# Altium schematic sheet STM32.SchDoc
size A4
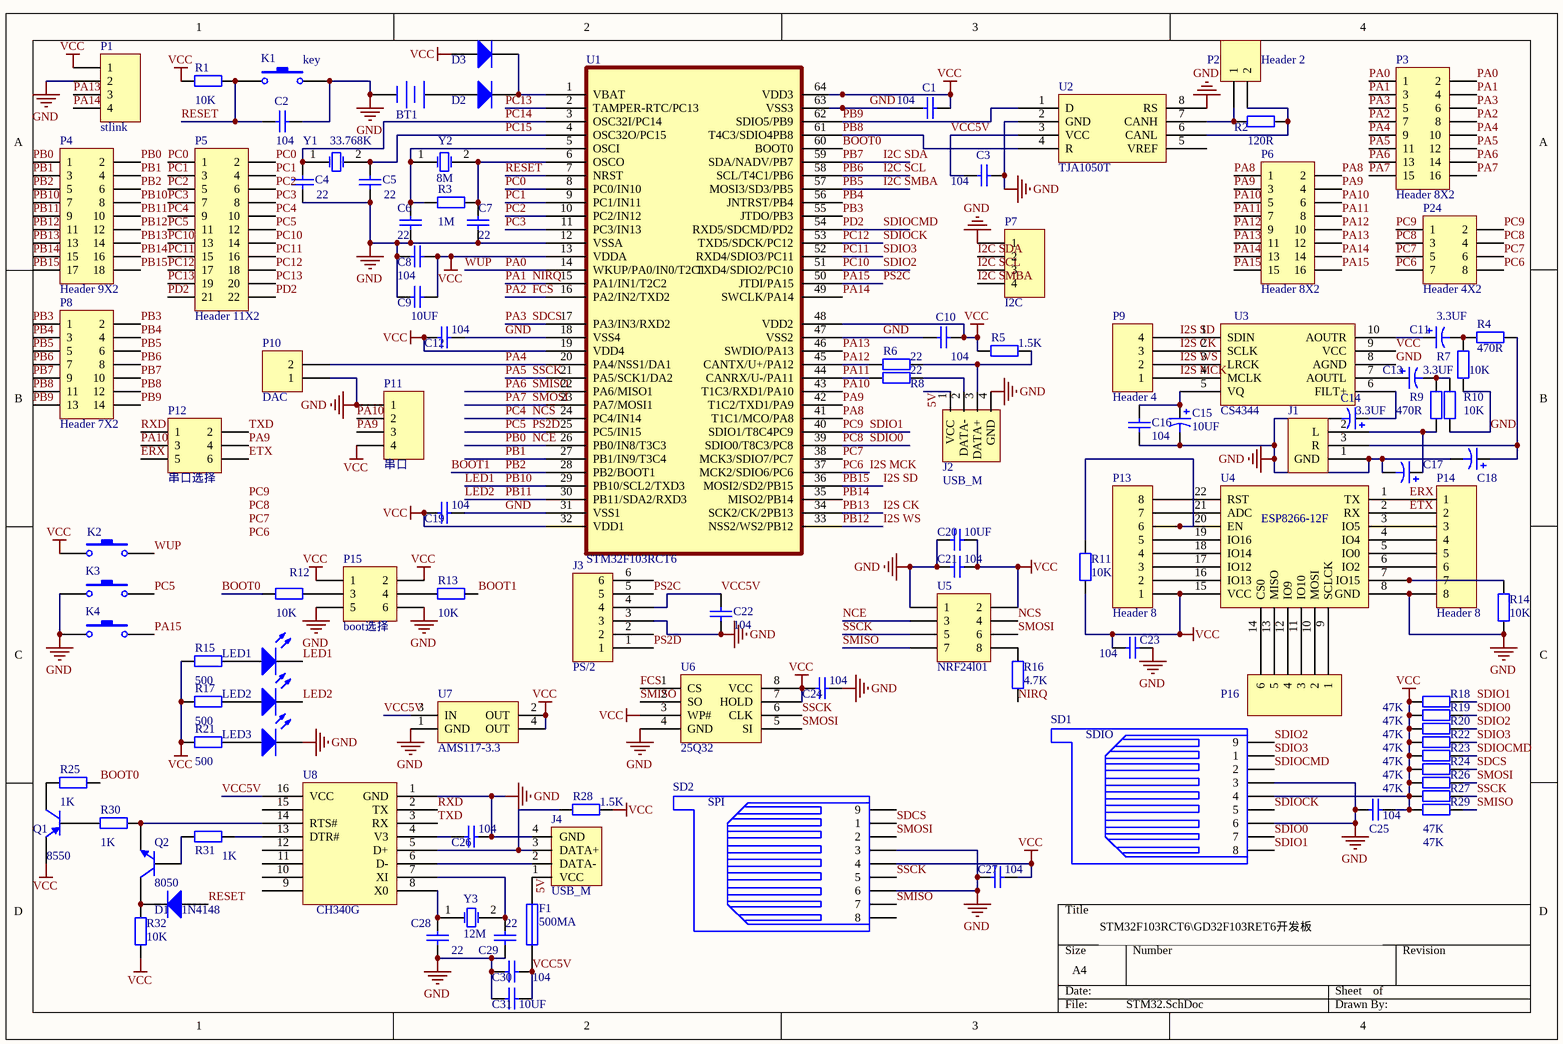
[diagram p0: STM32.SchDoc]

## Parts
BT1  电池  [电池座]  (value not drawn)
C1  value 104  [6-0805_N]  (hidden comment: Cap)
C2  value 104  [6-0805_N]  (hidden comment: Cap)
C3  value 104  [6-0805_N]  (hidden comment: Cap)
C4  value 22  [6-0805_N]  (hidden comment: Cap)
C5  value 22  [6-0805_N]  (hidden comment: Cap)
C6  value 22  [6-0805_N]  (hidden comment: Cap)
C7  value 22  [6-0805_N]  (hidden comment: Cap)
C8  value 104  [6-0805_N]  (hidden comment: Cap)
C9  value 10UF  [6-0805_N]  (hidden comment: Cap)
C10  value 104  [6-0805_N]  (hidden comment: Cap)
C11  value 3.3UF  [极性电容]  (hidden comment: Cap Pol3)
C12  value 104  [6-0805_N]  (hidden comment: Cap)
C13  value 3.3UF  [极性电容]  (hidden comment: Cap Pol3)
C14  value 3.3UF  [极性电容]  (hidden comment: Cap Pol3)
C15  value 10UF  [极性电容]  (hidden comment: Cap Pol3)
C16  value 104  [6-0805_N]  (hidden comment: Cap)
C17  Cap Pol3  [极性电容]  (value not drawn)
C18  Cap Pol3  [极性电容]  (value not drawn)
C19  value 104  [6-0805_N]  (hidden comment: Cap)
C20  value 10UF  [6-0805_N]  (hidden comment: Cap)
C21  value 104  [6-0805_N]  (hidden comment: Cap)
C22  value 104  [6-0805_N]  (hidden comment: Cap)
C23  value 104  [6-0805_N]  (hidden comment: Cap)
C24  value 104  [6-0805_N]  (hidden comment: Cap)
C25  value 104  [6-0805_N]  (hidden comment: Cap)
C26  value 104  [6-0805_N]  (hidden comment: Cap)
C27  value 104  [6-0805_N]  (hidden comment: Cap)
C28  value 22  [6-0805_N]  (hidden comment: Cap)
C29  value 22  [6-0805_N]  (hidden comment: Cap)
C30  value 104  [6-0805_N]  (hidden comment: Cap)
C31  value 10UF  [6-0805_N]  (hidden comment: Cap)
D1  1N4148  [1206]
D2  1N4148  [1206]  (value not drawn)
D3  1N4148  [1206]  (value not drawn)
F1  500MA  [1812]
J1  Component_1  [耳机座]  (value not drawn)
J2  USB_M  [USB MICRO]
J3  PS/2  [PS/2]
J4  USB_M  [USB MICRO]
K1  key  [按键]
K2  按键  [按键]  (value not drawn)
K3  按键  [按键]  (value not drawn)
K4  按键  [按键]  (value not drawn)
LED1  LED  [6-0805_N]  (value not drawn)
LED2  LED  [6-0805_N]  (value not drawn)
LED3  LED  [6-0805_N]  (value not drawn)
P1  stlink  [HDR1X4]
P2  Header 2  [HDR1X2]
P3  Header 8X2  [HDR2X8]
P4  Header 9X2  [HDR2X9]
P5  Header 11X2  [HDR2X11]
P6  Header 8X2  [HDR2X8]
P7  I2C  [HDR1X4]
P8  Header 7X2  [HDR2X7]
P9  Header 4  [HDR1X4]
P10  DAC  [HDR1X2]
P11  串口  [HDR1X4]
P12  串口选择  [HDR2X3]
P13  Header 8  [HDR1X8]
P14  Header 8  [HDR1X8]
P15  boot选择  [HDR2X3]
P16  Header 6  [HDR1X6]  (value not drawn)
P24  Header 4X2  [HDR2X4]
Q1  8550  [SOT-23B_N]
Q2  8050  [SOT-23B_N]
R1  value 10K  [6-0805_N]  (hidden comment: Res2)
R2  value 120R  [6-0805_N]  (hidden comment: Res2)
R3  value 1M  [6-0805_N]  (hidden comment: Res2)
R4  value 470R  [6-0805_N]  (hidden comment: Res2)
R5  value 1.5K  [6-0805_N]  (hidden comment: Res2)
R6  value 22  [6-0805_N]  (hidden comment: Res2)
R7  value 10K  [6-0805_N]  (hidden comment: Res2)
R8  value 22  [6-0805_N]  (hidden comment: Res2)
R9  value 470R  [6-0805_N]  (hidden comment: Res2)
R10  value 10K  [6-0805_N]  (hidden comment: Res2)
R11  value 10K  [6-0805_N]  (hidden comment: Res2)
R12  value 10K  [6-0805_N]  (hidden comment: Res2)
R13  value 10K  [6-0805_N]  (hidden comment: Res2)
R14  value 10K  [6-0805_N]  (hidden comment: Res2)
R15  value 500  [6-0805_N]  (hidden comment: Res2)
R16  value 4.7K  [6-0805_N]  (hidden comment: Res2)
R17  value 500  [6-0805_N]  (hidden comment: Res2)
R18  value 47K  [6-0805_N]  (hidden comment: Res2)
R19  value 47K  [6-0805_N]  (hidden comment: Res2)
R20  value 47K  [6-0805_N]  (hidden comment: Res2)
R21  value 500  [6-0805_N]  (hidden comment: Res2)
R22  value 47K  [6-0805_N]  (hidden comment: Res2)
R23  value 47K  [6-0805_N]  (hidden comment: Res2)
R24  value 47K  [6-0805_N]  (hidden comment: Res2)
R25  value 1K  [6-0805_N]  (hidden comment: Res2)
R26  value 47K  [6-0805_N]  (hidden comment: Res2)
R27  value 47K  [6-0805_N]  (hidden comment: Res2)
R28  value 1.5K  [6-0805_N]  (hidden comment: Res2)
R29  value 47K  [6-0805_N]  (hidden comment: Res2)
R30  value 1K  [6-0805_N]  (hidden comment: Res2)
R31  value 1K  [6-0805_N]  (hidden comment: Res2)
R32  value 10K  [6-0805_N]  (hidden comment: Res2)
SD1  A: SDIO  [TFCARD-M]  (hidden comment: PJS008-2000)
SD2  A: SPI  [SDCARD_A]  (hidden comment: PJS008-2000)
U1  STM32F103RCT6  [LQFP64]
U2  TJA1050T  [SO8_M]
U3  CS4344  [TSSOP110_s]
U4  Component_1  [ESP_12_f]  (value not drawn)
U5  NRF24l01  [HDR2X4]
U6  25Q32  [SO8_M]
U7  AMS117-3.3  [ZZ311]
U8  Component_1  [SO-16_M]  (value not drawn)
Y1  33.768K  [SIP2]
Y2  8M  [晶振]
Y3  12M  [晶振]

## Nets
GND: BT1.2(-) C1.2 C2.2 C3.1 C4.1 C5.1 C6.1 C7.1 C8.1 C9.1 C10.2 C12.2 C14.2 C15.2 C16.2 C17.2 C18.2 C19.2 C20.1 C21.2 C22.1 C23.2 C24.2 C25.2 C26.2 C27.2 C28.1 C29.1 C30.1 C31.1 J1.1(GND) J2.4(GND) J3.3 J4.4(GND) K1.2 K3.1 K4.1 LED3.2 P1.2 P7.1 P10.1 P11.1 P14.8 P15.5 P15.6 R7.1 R10.1 R14.1 SD1.3 SD1.6 SD2.3 SD2.6 U1.12(VSSA) U1.18(VSS4) U1.31(VSS1) U1.47(VSS2) U1.63(VSS3) U2.2(GND) U2.8(RS) U3.8(AGND) U4.8(GND) U5.1 U6.4(GND) U7.1(GND) U8.1(GND)
VCC: C1.1 C8.2 C9.2 C10.1 C12.1 C19.1 C20.2 C21.1 C23.1 C24.1 C25.1 C27.1 D3.1(A) K2.1 P1.1 P11.4 P13.1 P15.1 P15.2 Q1.3(E) R1.1 R5.1 R11.1 R15.1 R17.1 R18.1 R19.1 R20.1 R21.1 R22.1 R23.1 R24.1 R26.1 R27.1 R28.2 R29.1 R32.1 SD1.4 SD2.4 U1.13(VDDA) U1.19(VDD4) U1.32(VDD1) U1.48(VDD2) U1.64(VDD3) U3.9(VCC) U4.15(VCC) U5.2 U6.3(WP#) U6.7(HOLD) U6.8(VCC) U7.2(OUT) U7.4(OUT)
5V: F1.2 J2.1(VCC) J4.1(VCC)
BOOT0: R12.1 R25.2 U1.60(BOOT0)
BOOT1: P4.5 P4.6 R13.2 U1.28(PB2/BOOT1)  [also labelled PB2]
ERX: P12.5 P14.1 U4.1(TX)
ETX: P12.6 P14.2 U4.2(RX)
FCS: P3.7 P3.8 U1.16(PA2/IN2/TXD2) U6.1(CS)  [also labelled PA2]
I2C SCL: P7.3 P8.7 P8.8 U1.58(SCL/T4C1/PB6)  [also labelled PB6]
I2C SDA: P7.2 P8.9 P8.10 U1.59(SDA/NADV/PB7)  [also labelled PB7]
I2C SMBA: P7.4 P8.5 P8.6 U1.57(MOSI3/SD3/PB5)  [also labelled PB5]
I2S CK: P4.13 P4.14 P9.3 U1.34(SCK2/CK/2PB13) U3.2(SCLK)  [also labelled PB13]
I2S MCK: P9.1 P24.7 P24.8 U1.37(MCK2/SDIO6/PC6) U3.4(MCLK)  [also labelled PC6]
I2S SD: P4.17 P4.18 P9.4 U1.36(MOSI2/SD2/PB15) U3.1(SDIN)  [also labelled PB15]
I2S WS: P4.11 P4.12 P9.2 U1.33(NSS2/WS2/PB12) U3.3(LRCK)  [also labelled PB12]
LED1: LED1.2 P4.7 P4.8 U1.29(PB10/SCL2/TXD3)  [also labelled PB10]
LED2: LED2.2 P4.9 P4.10 U1.30(PB11/SDA2/RXD3)  [also labelled PB11]
NCE: P4.1 P4.2 U1.26(PB0/IN8/T3C3) U5.3  [also labelled PB0]
NCS: P5.9 P5.10 U1.24(PC4/IN14) U5.4  [also labelled PC4]
NIRQ: P3.3 P3.4 R16.2 U1.15(PA1/IN1/T2C2)  [also labelled PA1]
PA0: K2.2 P3.1 P3.2 U1.14(WKUP/PA0/IN0/T2C1)  [also labelled WUP]
PA3: P3.5 P3.6 R24.2 SD2.1 U1.17(PA3/IN3/RXD2)  [also labelled SDCS]
PA4: P3.9 P3.10 P10.2 U1.20(PA4/NSS1/DA1)
PA5: P3.11 P3.12 R27.2 SD2.5 U1.21(PA5/SCK1/DA2) U5.5 U6.6(CLK)  [also labelled SSCK]
PA6: P3.13 P3.14 R29.2 SD2.7 U1.22(PA6/MISO1) U5.7 U6.2(SO)  [also labelled SMISO]
PA7: P3.15 P3.16 R26.2 SD2.2 U1.23(PA7/MOSI1) U5.6 U6.5(SI)  [also labelled SMOSI]
PA8: P6.1 P6.2 U1.41(T1C1/MCO/PA8)
PA9: P6.3 P6.4 P11.3 P12.4 U1.42(T1C2/TXD1/PA9)
PA10: P6.5 P6.6 P11.2 P12.3 U1.43(T1C3/RXD1/PA10)
PA11: P6.7 P6.8 R8.1 U1.44(CANRX/U-/PA11)
PA12: P6.9 P6.10 R6.1 U1.45(CANTX/U+/PA12)
PA13: P1.3 P6.11 P6.12 U1.46(SWDIO/PA13)
PA14: P1.4 P6.13 P6.14 U1.49(SWCLK/PA14)
PA15: J3.5 K4.2 P6.15 P6.16 U1.50(JTDI/PA15)  [also labelled PS2C]
PB1: P4.3 P4.4 U1.27(PB1/IN9/T3C4)
PB3: P8.1 P8.2 U1.55(JTDO/PB3)
PB4: P8.3 P8.4 U1.56(JNTRST/PB4)
PB8: P8.11 P8.12 U1.61(T4C3/SDIO4PB8) U2.4(R)
PB9: P8.13 P8.14 U1.62(SDIO5/PB9) U2.1(D)
PB14: P4.15 P4.16 U1.35(MISO2/PB14)
PC0: P5.1 P5.2 U1.8(PC0/IN10)
PC1: P5.3 P5.4 U1.9(PC1/IN11)
PC2: P5.5 P5.6 U1.10(PC2/IN12)
PC3: P5.7 P5.8 U1.11(PC3/IN13)
PC5: J3.1 K3.2 P5.11 P5.12 U1.25(PC5/IN15)  [also labelled PS2D]
PC7: P24.5 P24.6 U1.38(MCK3/SDIO7/PC7)
PC8: P24.3 P24.4 R19.2 SD1.7 U1.39(SDIO0/T8C3/PC8)  [also labelled SDIO0]
PC9: P24.1 P24.2 R18.2 SD1.8 U1.40(SDIO1/T8C4PC9)  [also labelled SDIO1]
PC10: P5.13 P5.14 R20.2 SD1.9 U1.51(TXD4/SDIO2/PC10)  [also labelled SDIO2]
PC11: P5.15 P5.16 R22.2 SD1.1 U1.52(RXD4/SDIO3/PC11)  [also labelled SDIO3]
PC12: P5.17 P5.18 SD1.5 U1.53(TXD5/SDCK/PC12)  [also labelled SDIOCK]
PC13: P5.19 P5.20 U1.2(TAMPER-RTC/PC13)
PC14: C4.2 U1.3(OSC32I/PC14) Y1.1(OSC1)
PC15: C5.2 U1.4(OSC32O/PC15) Y1.2(OSC2)
PD2: P5.21 P5.22 R23.2 SD1.2 U1.54(RXD5/SDCMD/PD2)  [also labelled SDIOCMD]
RESET: C2.1 D1.1(A) K1.1 R1.2 U1.7(NRST)
RXD: P12.1 U8.2(TX)
TXD: P12.2 U8.3(RX)
VCC5V: C3.2 C22.2 C30.2 C31.2 F1.1 J3.4 U2.3(VCC) U7.3(IN) U8.16(VCC)
NetBT1_1: BT1.1(+) D2.1(A)
NetC6_2: C6.2 R3.1 U1.5(OSCI) Y2.1(OSC1)
NetC7_2: C7.2 R3.2 U1.6(OSCO) Y2.2(OSC2)
NetC11_1: C11.1 U3.10(AOUTR)
NetC11_2: C11.2 R4.2 R7.2
NetC13_1: C13.1 U3.7(AOUTL)
NetC13_2: C13.2 R9.1 R10.2
NetC14_1: C14.1 U3.6(FILT+)
NetC15_1: C15.1 C16.1 U3.5(VQ)
NetC17_1: C17.1 J1.2(L) R9.2
NetC18_1: C18.1 J1.3(R) R4.1
NetC26_1: C26.1 U8.4(V3)
NetC28_2: C28.2 U8.8(X0) Y3.1(OSC1)
NetC29_2: C29.2 U8.7(XI) Y3.2(OSC2)
NetD1_2: D1.2(K) Q2.1(C) R32.2
NetD2_2: D2.2(K) D3.2(K) U1.1(VBAT)
NetJ2_2: J2.2(DATA-) R8.2
NetJ2_3: J2.3(DATA+) R5.2 R6.2
NetJ4_2: J4.2(DATA-) U8.6(D-)
NetJ4_3: J4.3(DATA+) R28.1 U8.5(D+)
NetLED1_1: LED1.1 R15.2
NetLED2_1: LED2.1 R17.2
NetLED3_1: LED3.1 R21.2
NetP2_1: P2.1 R2.1 U2.7(CANH)
NetP2_2: P2.2 R2.2 U2.6(CANL)
NetP13_2: P13.2 U4.16(IO13)
NetP13_3: P13.3 U4.17(IO12)
NetP13_4: P13.4 U4.18(IO14)
NetP13_5: P13.5 U4.19(IO16)
NetP13_6: P13.6 R11.2 U4.20(EN)
NetP13_7: P13.7 U4.21(ADC)
NetP13_8: P13.8 U4.22(RST)
NetP14_3: P14.3 U4.3(IO5)
NetP14_4: P14.4 U4.4(IO4)
NetP14_5: P14.5 U4.5(IO0)
NetP14_6: P14.6 U4.6(IO2)
NetP14_7: P14.7 R14.2 U4.7(IO15)
NetP15_3: P15.3 R12.2
NetP15_4: P15.4 R13.1
NetP16_1: P16.1 U4.9(SCLCK)
NetP16_2: P16.2 U4.10(MOSI)
NetP16_3: P16.3 U4.11(IO10)
NetP16_4: P16.4 U4.12(IO9)
NetP16_5: P16.5 U4.13(MISO)
NetP16_6: P16.6 U4.14(CS0)
NetQ1_1: Q1.1(C) R25.1
NetQ1_2: Q1.2(B) R30.1
NetQ2_2: Q2.2(B) R31.1
NetQ2_3: Q2.3(E) R30.2 U8.14(RTS#)
NetR16_1: R16.1 U5.8
NetR31_2: R31.2 U8.13(DTR#)

Not connected (* = marked no-connect by the designer): J3 2 6; SD2 8 9; U2 5(VREF); U8 9 10 11 12 15

## Notes on the sheet
- STM32F103RCT6\GD32F103RET6开发板
- Labels drawn without touching a wire or pin: PC6, PC7, PC8, PC9
- (in symbol Component_1) CH340G; ESP8266-12F

## Library data of the parts
C1-C10 C12 C16 C19-C31 = Cap: Capacitor; Published: 8-Jun-2000; LatestRevisionDate: 17-Jul-2002; LatestRevisionNote: Re-released for DXP Platform.; PackageReference: RAD-0.3; Publisher: Altium Limited; PackageDescription: Radial Cap, Thru-Hole; 2 Leads; 0.3 in Pin Spacing
C11 C13-C15 = Cap Pol3: Polarized Capacitor (Surface Mount); Published: 8-Jun-2000; LatestRevisionDate: 29-May-2009; LatestRevisionNote: IPC-7351 Footprint Added.; PackageReference: C0805; Publisher: Altium Limited; PackageDescription: Chip Capacitor
C17 C18 = Cap Pol3: Polarized Capacitor (Surface Mount); Value: 3.3UF; Published: 8-Jun-2000; LatestRevisionDate: 29-May-2009; LatestRevisionNote: IPC-7351 Footprint Added.; PackageReference: C0805; Publisher: Altium Limited; PackageDescription: Chip Capacitor
D1-D3 = Diode 1N4148: High Conductance Fast Diode; Published: 8-Jun-2000; LatestRevisionDate: 17-Jul-2002; LatestRevisionNote: Re-released for DXP Platform.; DatasheetVersion: 1997; PackageReference: DO-35; Publisher: Altium Limited; PackageDescription: Diode, Axial; Body 3.8 x 1.9 mm (LxDia. max), Lead Dia. 0.53 mm (max); Code_JEDEC: DO-204-AH; ComponentLink1Description: Manufacturer Link; ComponentLink1URL: http://www.fairchildsemi.com/; ComponentLink2Description: Datasheet; ComponentLink2URL: http://www.fairchildsemi.com/ds/1N%2F1N4148.pdf
F1 = Fuse 1: Fuse; Published: 8-Jun-2000; LatestRevisionDate: 17-Jul-2002; LatestRevisionNote: Re-released for DXP Platform.; PackageReference: PIN-W2/E2.8; Publisher: Altium Limited; PackageDescription: Thru-Hole; 2 Leads
K1 = 按键
LED1-LED3 = 发光二极管
P1 P7 P9 P11 = Header 4: Header, 4-Pin; LatestRevisionDate: 17-Jul-2002; LatestRevisionNote: Re-released for DXP Platform.; Publisher: Altium Limited
P2 P10 = Header 2: Header, 2-Pin; LatestRevisionDate: 17-Jul-2002; LatestRevisionNote: Re-released for DXP Platform.; Publisher: Altium Limited
P3 P6 = Header 8X2: Header, 8-Pin, Dual row; LatestRevisionDate: 17-Jul-2002; LatestRevisionNote: Re-released for DXP Platform.; Publisher: Altium Limited
P4 = Header 9X2: Header, 9-Pin, Dual row; LatestRevisionDate: 17-Jul-2002; LatestRevisionNote: Re-released for DXP Platform.; Publisher: Altium Limited
P5 = Header 11X2: Header, 11-Pin, Dual row; LatestRevisionDate: 17-Jul-2002; LatestRevisionNote: Re-released for DXP Platform.; Publisher: Altium Limited
P8 = Header 7X2: Header, 7-Pin, Dual row; LatestRevisionDate: 17-Jul-2002; LatestRevisionNote: Re-released for DXP Platform.; Publisher: Altium Limited
P12 P15 = Header 3X2: Header, 3-Pin, Dual row; LatestRevisionDate: 17-Jul-2002; LatestRevisionNote: Re-released for DXP Platform.; Publisher: Altium Limited
P13 P14 = Header 8: Header, 8-Pin; LatestRevisionDate: 17-Jul-2002; LatestRevisionNote: Re-released for DXP Platform.; Publisher: Altium Limited
P16 = Header 6: Header, 6-Pin; LatestRevisionDate: 17-Jul-2002; LatestRevisionNote: Re-released for DXP Platform.; Publisher: Altium Limited
P24 U5 = Header 4X2: Header, 4-Pin, Dual row; LatestRevisionDate: 17-Jul-2002; LatestRevisionNote: Re-released for DXP Platform.; Publisher: Altium Limited
Q1 = PNP: PNP Bipolar Transistor; Published: 8-Jun-2000; LatestRevisionDate: 29-May-2009; LatestRevisionNote: IPC-7351 Footprint Added.; PackageVersion: Aug-1999; PackageReference: SOT-23B; Publisher: Altium Limited; PackageDescription: 3-Pin SOT-23 Package 0.95 mm Pitch, 2.4 mm Lead Span
Q2 = NPN: NPN Bipolar Transistor; Published: 8-Jun-2000; LatestRevisionDate: 17-Jul-2002; LatestRevisionNote: Re-released for DXP Platform.; PackageReference: TO-226-AA; Publisher: Altium Limited; PackageDescription: TO, Flat Index; 3 In-Line, Axial Leads; Body Dia. 4.8mm; Leads 0.55 x 0.51 mm (max); Code_JEDEC: TO-226-AA
R1-R32 = Res2: Resistor; Published: 8-Jun-2000; LatestRevisionDate: 17-Jul-2002; LatestRevisionNote: Re-released for DXP Platform.; PackageReference: AXIAL-0.4; Publisher: Altium Limited; PackageDescription: Axial Device, Thru-Hole; 2 Leads; 0.4 in Pin Spacing
SD1 SD2 = SMS016AFA5E
U1 = STM32F103RDT6: ST High-density performance line ARM-based 32-bit MCU with 256 to  512KB Flash, USB, CAN, 11 timers, 3 ADCs, 13 communication interfaces
U2 U3 U6 = Component_1
U7 = REG1117-3.3: 800mA and 1A Low Dropout Positive Regulator 2.85V, 3.3V, 5V, and Adjustable; Published: 8-Jun-2000; LatestRevisionDate: 17-Jul-2002; LatestRevisionNote: Re-released for DXP Platform.; DatasheetVersion: Sep-1997; PackageVersion: revC; PackageReference: ZZ311; Publisher: Altium Limited; PackageDescription: SOT-223/SC-73; 4 Leads; Body 6.7 x 7.3 mm, inc. leads (LxW max); ComponentLink1Description: Manufacturer Link; ComponentLink1URL: http://www.ti.com/; ComponentLink2Description: Datasheet; ComponentLink2URL: http://www-s.ti.com/sc/ds/REG1117.pdf
Y1-Y3 = 晶振